# Altium project STM32F103RCT6最小系统.PrjPCB
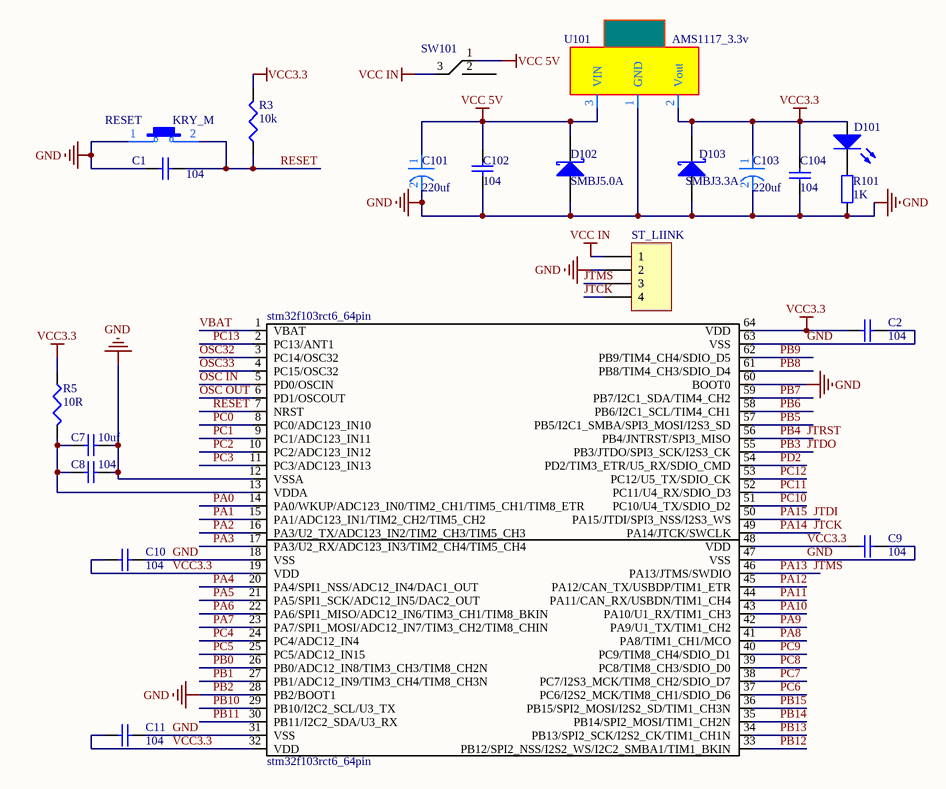
[diagram p0: STM32F103RCT6最小系统.SchDoc]
1 sheet, 22 parts. Net scope: global (net labels, ports and power ports of the same name join across sheets).
Board file: STM32F103RCT6最小系统.PcbDoc

## Sheet STM32F103RCT6最小系统.SchDoc
size A4

### Parts
C1  value 104  [C1206]  (hidden comment: Cap Semi)
C2  value 104  [C1206]  (hidden comment: Cap Semi)
C7  value 10uf  [C1206]  (hidden comment: Cap Semi)
C8  value 104  [C1206]  (hidden comment: Cap Semi)
C9  value 104  [C1206]  (hidden comment: Cap Semi)
C10  value 104  [C1206]  (hidden comment: Cap Semi)
C11  value 104  [C1206]  (hidden comment: Cap Semi)
C101  value 220uf  [电解电容]  (hidden comment: 电解电容)
C102  value 104  [C1206]  (hidden comment: Cap Semi)
C103  value 220uf  [电解电容]  (hidden comment: 电解电容)
C104  value 104  [C1206]  (hidden comment: Cap Semi)
D101  LED  [3.5X2.8X1.9]  (value not drawn)
D102  SMBJ5.0A  [SMB]
D103  SMBJ3.3A  [SMB]
R3  value 10k  [C1206]  (hidden comment: Res3)
R5  value 10R  [C1206]  (hidden comment: Res3)
R101  value 1K  [AXIAL-0.4]  (hidden comment: Res2)
RESET  KRY_M  [SW_4c]
ST_LIINK  Header 4  [HDR1X4]  (value not drawn)
stm32f103rct6_64pin  stm32f103rct6_64pin  [stm32f103rct6_64pin]
SW101  三脚开关  [三脚开关]  (value not drawn)
U101  AMS1117_3.3v  [AMS1117_3.3V]

### Nets
GND: C1.1 C2.1 C7.2 C8.1 C9.1 C10.1 C11.1 C101.2 C102.1 C103.2 C104.1 D102.1(A) D103.1(A) R101.1 RESET.1 ST_LIINK.2 stm32f103rct6_64pin.12(VSSA) stm32f103rct6_64pin.18(VSS) stm32f103rct6_64pin.28(PB2/BOOT1) stm32f103rct6_64pin.31(VSS) stm32f103rct6_64pin.47(VSS) stm32f103rct6_64pin.60(BOOT0) stm32f103rct6_64pin.63(VSS) U101.1(GND)  [also labelled PB2]
VCC3.3: C2.2 C9.2 C10.2 C11.2 C103.1 C104.2 D101.1(A) D103.2(K) R3.2 R5.1 stm32f103rct6_64pin.19(VDD) stm32f103rct6_64pin.32(VDD) stm32f103rct6_64pin.48(VDD) stm32f103rct6_64pin.64(VDD) U101.2(Vout)
VCC 5V: C101.1 C102.2 D102.2(K) SW101.1 U101.3(VIN)
VCC IN: ST_LIINK.1 SW101.3
JTCK: ST_LIINK.4 stm32f103rct6_64pin.49(PA14/JTCK/SWCLK)  [also labelled PA14]
JTDI: stm32f103rct6_64pin.50(PA15/JTDI/SPI3_NSS/I2S3_WS)  [also labelled PA15]
JTDO: stm32f103rct6_64pin.55(PB3/JTDO/SPI3_SCK/I2S3_CK)  [also labelled PB3]
JTMS: ST_LIINK.3 stm32f103rct6_64pin.46(PA13/JTMS/SWDIO)  [also labelled PA13]
JTRST: stm32f103rct6_64pin.56(PB4/JNTRST/SPI3_MISO)  [also labelled PB4]
OSC32: stm32f103rct6_64pin.3(PC14/OSC32)
OSC33: stm32f103rct6_64pin.4(PC15/OSC32)
OSC IN: stm32f103rct6_64pin.5(PD0/OSCIN)
OSC OUT: stm32f103rct6_64pin.6(PD1/OSCOUT)
PA0: stm32f103rct6_64pin.14(PA0/WKUP/ADC123_IN0/TIM2_CH1/TIM5_CH1/TIM8_ETR)
PA1: stm32f103rct6_64pin.15(PA1/ADC123_IN1/TIM2_CH2/TIM5_CH2)
PA2: stm32f103rct6_64pin.16(PA3/U2_TX/ADC123_IN2/TIM2_CH3/TIM5_CH3)
PA3: stm32f103rct6_64pin.17(PA3/U2_RX/ADC123_IN3/TIM2_CH4/TIM5_CH4)
PA4: stm32f103rct6_64pin.20(PA4/SPI1_NSS/ADC12_IN4/DAC1_OUT)
PA5: stm32f103rct6_64pin.21(PA5/SPI1_SCK/ADC12_IN5/DAC2_OUT)
PA6: stm32f103rct6_64pin.22(PA6/SPI1_MISO/ADC12_IN6/TIM3_CH1/TIM8_BKIN)
PA7: stm32f103rct6_64pin.23(PA7/SPI1_MOSI/ADC12_IN7/TIM3_CH2/TIM8_CHIN)
PA8: stm32f103rct6_64pin.41(PA8/TIM1_CH1/MCO)
PA9: stm32f103rct6_64pin.42(PA9/U1_TX/TIM1_CH2)
PA10: stm32f103rct6_64pin.43(PA10/U1_RX/TIM1_CH3)
PA11: stm32f103rct6_64pin.44(PA11/CAN_RX/USBDN/TIM1_CH4)
PA12: stm32f103rct6_64pin.45(PA12/CAN_TX/USBDP/TIM1_ETR)
PB0: stm32f103rct6_64pin.26(PB0/ADC12_IN8/TIM3_CH3/TIM8_CH2N)
PB1: stm32f103rct6_64pin.27(PB1/ADC12_IN9/TIM3_CH4/TIM8_CH3N)
PB5: stm32f103rct6_64pin.57(PB5/I2C1_SMBA/SPI3_MOSI/I2S3_SD)
PB6: stm32f103rct6_64pin.58(PB6/I2C1_SCL/TIM4_CH1)
PB7: stm32f103rct6_64pin.59(PB7/I2C1_SDA/TIM4_CH2)
PB8: stm32f103rct6_64pin.61(PB8/TIM4_CH3/SDIO_D4)
PB9: stm32f103rct6_64pin.62(PB9/TIM4_CH4/SDIO_D5)
PB10: stm32f103rct6_64pin.29(PB10/I2C2_SCL/U3_TX)
PB11: stm32f103rct6_64pin.30(PB11/I2C2_SDA/U3_RX)
PB12: stm32f103rct6_64pin.33(PB12/SPI2_NSS/I2S2_WS/I2C2_SMBA1/TIM1_BKIN)
PB13: stm32f103rct6_64pin.34(PB13/SPI2_SCK/I2S2_CK/TIM1_CH1N)
PB14: stm32f103rct6_64pin.35(PB14/SPI2_MOSI/TIM1_CH2N)
PB15: stm32f103rct6_64pin.36(PB15/SPI2_MOSI/I2S2_SD/TIM1_CH3N)
PC0: stm32f103rct6_64pin.8(PC0/ADC123_IN10)
PC1: stm32f103rct6_64pin.9(PC1/ADC123_IN11)
PC2: stm32f103rct6_64pin.10(PC2/ADC123_IN12)
PC3: stm32f103rct6_64pin.11(PC3/ADC123_IN13)
PC4: stm32f103rct6_64pin.24(PC4/ADC12_IN4)
PC5: stm32f103rct6_64pin.25(PC5/ADC12_IN15)
PC6: stm32f103rct6_64pin.37(PC6/I2S2_MCK/TIM8_CH1/SDIO_D6)
PC7: stm32f103rct6_64pin.38(PC7/I2S3_MCK/TIM8_CH2/SDIO_D7)
PC8: stm32f103rct6_64pin.39(PC8/TIM8_CH3/SDIO_D0)
PC9: stm32f103rct6_64pin.40(PC9/TIM8_CH4/SDIO_D1)
PC10: stm32f103rct6_64pin.51(PC10/U4_TX/SDIO_D2)
PC11: stm32f103rct6_64pin.52(PC11/U4_RX/SDIO_D3)
PC12: stm32f103rct6_64pin.53(PC12/U5_TX/SDIO_CK)
PC13: stm32f103rct6_64pin.2(PC13/ANT1)
PD2: stm32f103rct6_64pin.54(PD2/TIM3_ETR/U5_RX/SDIO_CMD)
RESET: C1.2 R3.1 RESET.2 stm32f103rct6_64pin.7(NRST)
VBAT: stm32f103rct6_64pin.1(VBAT)
NetC7_1: C7.1 C8.2 R5.2 stm32f103rct6_64pin.13(VDDA)
NetD101_2: D101.2(K) R101.2

Not connected (* = marked no-connect by the designer): SW101 2

### Library data of the parts
C1 C2 C7-C11 C102 C104 = Cap Semi: Capacitor (Semiconductor SIM Model); Published: 8-Jun-2000; LatestRevisionDate: 29-May-2009; LatestRevisionNote: IPC-7351 Footprint Added.; PackageReference: C1206; Publisher: Altium Limited; PackageDescription: Chip Capacitor
D101 = LED_: 发光二极管
D102 D103 = D Schottky: Schottky Diode; Published: 8-Jun-2000; LatestRevisionDate: 17-Jul-2002; LatestRevisionNote: Re-released for DXP Platform.; PackageReference: SMB; Publisher: Altium Limited; PackageDescription: DO-214-AA/SMB; 2 C-Bend Leads; Body 5.3 x 3.6 mm, inc. leads (LxW); Code_JEDEC: DO-214-AA
R3 R5 = Res3: Resistor; Published: 8-Jun-2000; LatestRevisionDate: 29-May-2009; LatestRevisionNote: IPC-7351 Footprint Added.; PackageReference: J1-0603; Publisher: Altium Limited; PackageDescription: Chip Resistor
R101 = Res2: Resistor; Published: 8-Jun-2000; LatestRevisionDate: 17-Jul-2002; LatestRevisionNote: Re-released for DXP Platform.; PackageReference: AXIAL-0.4; Publisher: Altium Limited; PackageDescription: Axial Device, Thru-Hole; 2 Leads; 0.4 in Pin Spacing
RESET = SW_4t
ST_LIINK = Header 4: Header, 4-Pin; LatestRevisionDate: 17-Jul-2002; LatestRevisionNote: Re-released for DXP Platform.; Publisher: Altium Limited